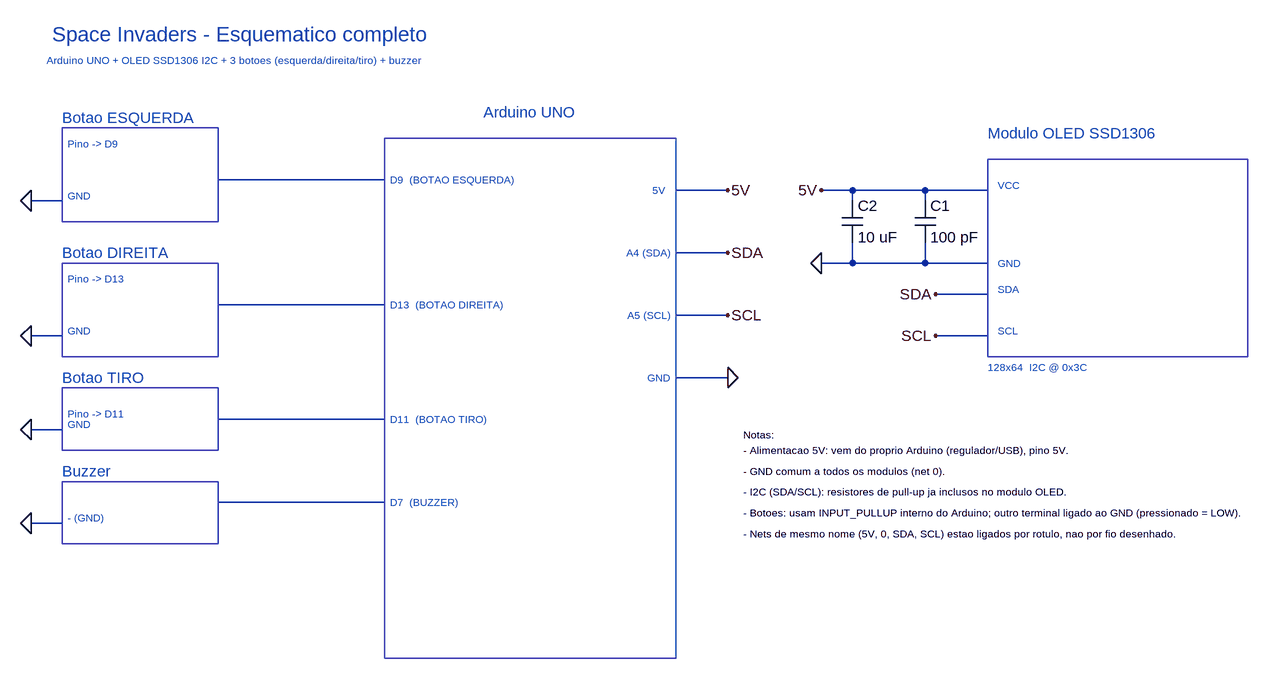
[diagram p0: schematic Draft1.asc]
Draft1.asc, the LTspice schematic file:
Version 4.1
SHEET 1 2656 1360
WIRE 688 368 432 368
WIRE 1216 384 1136 384
WIRE 1408 384 1360 384
WIRE 1520 384 1408 384
WIRE 1616 384 1520 384
WIRE 192 400 144 400
WIRE 1408 400 1408 384
WIRE 1520 400 1520 384
WIRE 1216 480 1136 480
WIRE 1408 496 1408 464
WIRE 1408 496 1360 496
WIRE 1520 496 1520 464
WIRE 1520 496 1408 496
WIRE 1616 496 1520 496
WIRE 1616 544 1536 544
WIRE 688 560 432 560
WIRE 1216 576 1136 576
WIRE 192 608 144 608
WIRE 1616 608 1536 608
WIRE 1216 672 1136 672
WIRE 688 736 432 736
WIRE 192 752 144 752
WIRE 688 864 432 864
WIRE 192 896 144 896
FLAG 144 400 0
FLAG 144 608 0
FLAG 144 752 0
FLAG 144 896 0
FLAG 1216 384 5V
FLAG 1216 480 SDA
FLAG 1216 576 SCL
FLAG 1216 672 0
FLAG 1360 384 5V
FLAG 1360 496 0
FLAG 1536 544 SDA
FLAG 1536 608 SCL
SYMBOL cap 1504 400 R0
SYMATTR InstName C1
SYMATTR Value 100 pF
SYMBOL cap 1392 400 R0
SYMATTR InstName C2
SYMATTR Value 10 uF
TEXT 176 144 Left 3 ;Space Invaders - Esquematico completo
TEXT 168 184 Left 1 ;Arduino UNO + OLED SSD1306 I2C + 3 botoes (esquerda/direita/tiro) + buzzer
TEXT 840 264 Left 2 ;Arduino UNO
TEXT 696 368 Left 1 ;D9  (BOTAO ESQUERDA)
TEXT 696 560 Left 1 ;D13  (BOTAO DIREITA)
TEXT 696 736 Left 1 ;D11  (BOTAO TIRO)
TEXT 696 864 Left 1 ;D7  (BUZZER)
TEXT 1120 384 Right 1 ;5V
TEXT 1128 480 Right 1 ;A4 (SDA)
TEXT 1128 576 Right 1 ;A5 (SCL)
TEXT 1128 672 Right 1 ;GND
TEXT 192 272 Left 2 ;Botao ESQUERDA
TEXT 200 312 Left 1 ;Pino -> D9
TEXT 200 392 Left 1 ;GND
TEXT 192 480 Left 2 ;Botao DIREITA
TEXT 200 520 Left 1 ;Pino -> D13
TEXT 200 600 Left 1 ;GND
TEXT 192 672 Left 2 ;Botao TIRO
TEXT 200 728 Left 1 ;Pino -> D11
TEXT 200 744 Left 1 ;GND
TEXT 192 816 Left 2 ;Buzzer
TEXT 200 888 Left 1 ;- (GND)
TEXT 1616 296 Left 2 ;Modulo OLED SSD1306
TEXT 1616 656 Left 1 ;128x64  I2C @ 0x3C
TEXT 1632 376 Left 1 ;VCC
TEXT 1632 496 Left 1 ;GND
TEXT 1632 536 Left 1 ;SDA
TEXT 1632 600 Left 1 ;SCL
TEXT 1240 760 Left 1 !Notas:
TEXT 1240 784 Left 1 !- Alimentacao 5V: vem do proprio Arduino (regulador/USB), pino 5V.
TEXT 1240 816 Left 1 !- GND comum a todos os modulos (net 0).
TEXT 1240 848 Left 1 !- I2C (SDA/SCL): resistores de pull-up ja inclusos no modulo OLED.
TEXT 1240 880 Left 1 !- Botoes: usam INPUT_PULLUP interno do Arduino; outro terminal ligado ao GND (pressionado = LOW).
TEXT 1240 912 Left 1 !- Nets de mesmo nome (5V, 0, SDA, SCL) estao ligados por rotulo, nao por fio desenhado.
RECTANGLE Normal 688 304 1136 1104
RECTANGLE Normal 192 288 432 432
RECTANGLE Normal 192 496 432 640
RECTANGLE Normal 192 688 432 784
RECTANGLE Normal 192 832 432 928
RECTANGLE Normal 1616 336 2016 640

The netlist it stands for:
* Draft1.asc
C1 5V 0 100 pF
C2 5V 0 10 uF
* Space Invaders - Esquematico completo
* Arduino UNO + OLED SSD1306 I2C + 3 botoes (esquerda/direita/tiro) + buzzer
* Arduino UNO
* D9  (BOTAO ESQUERDA)
* D13  (BOTAO DIREITA)
* D11  (BOTAO TIRO)
* D7  (BUZZER)
* 5V
* A4 (SDA)
* A5 (SCL)
* GND
* Botao ESQUERDA
* Pino -> D9
* GND
* Botao DIREITA
* Pino -> D13
* GND
* Botao TIRO
* Pino -> D11
* GND
* Buzzer
* - (GND)
* Modulo OLED SSD1306
* 128x64  I2C @ 0x3C
* VCC
* GND
* SDA
* SCL
Notas:
- Alimentacao 5V: vem do proprio Arduino (regulador/USB), pino 5V.
- GND comum a todos os modulos (net 0).
- I2C (SDA/SCL): resistores de pull-up ja inclusos no modulo OLED.
- Botoes: usam INPUT_PULLUP interno do Arduino; outro terminal ligado ao GND (pressionado = LOW).
- Nets de mesmo nome (5V, 0, SDA, SCL) estao ligados por rotulo, nao por fio desenhado.
.backanno
.end